# EAGLE design e1_xcvr (EAGLE 7.6.0)
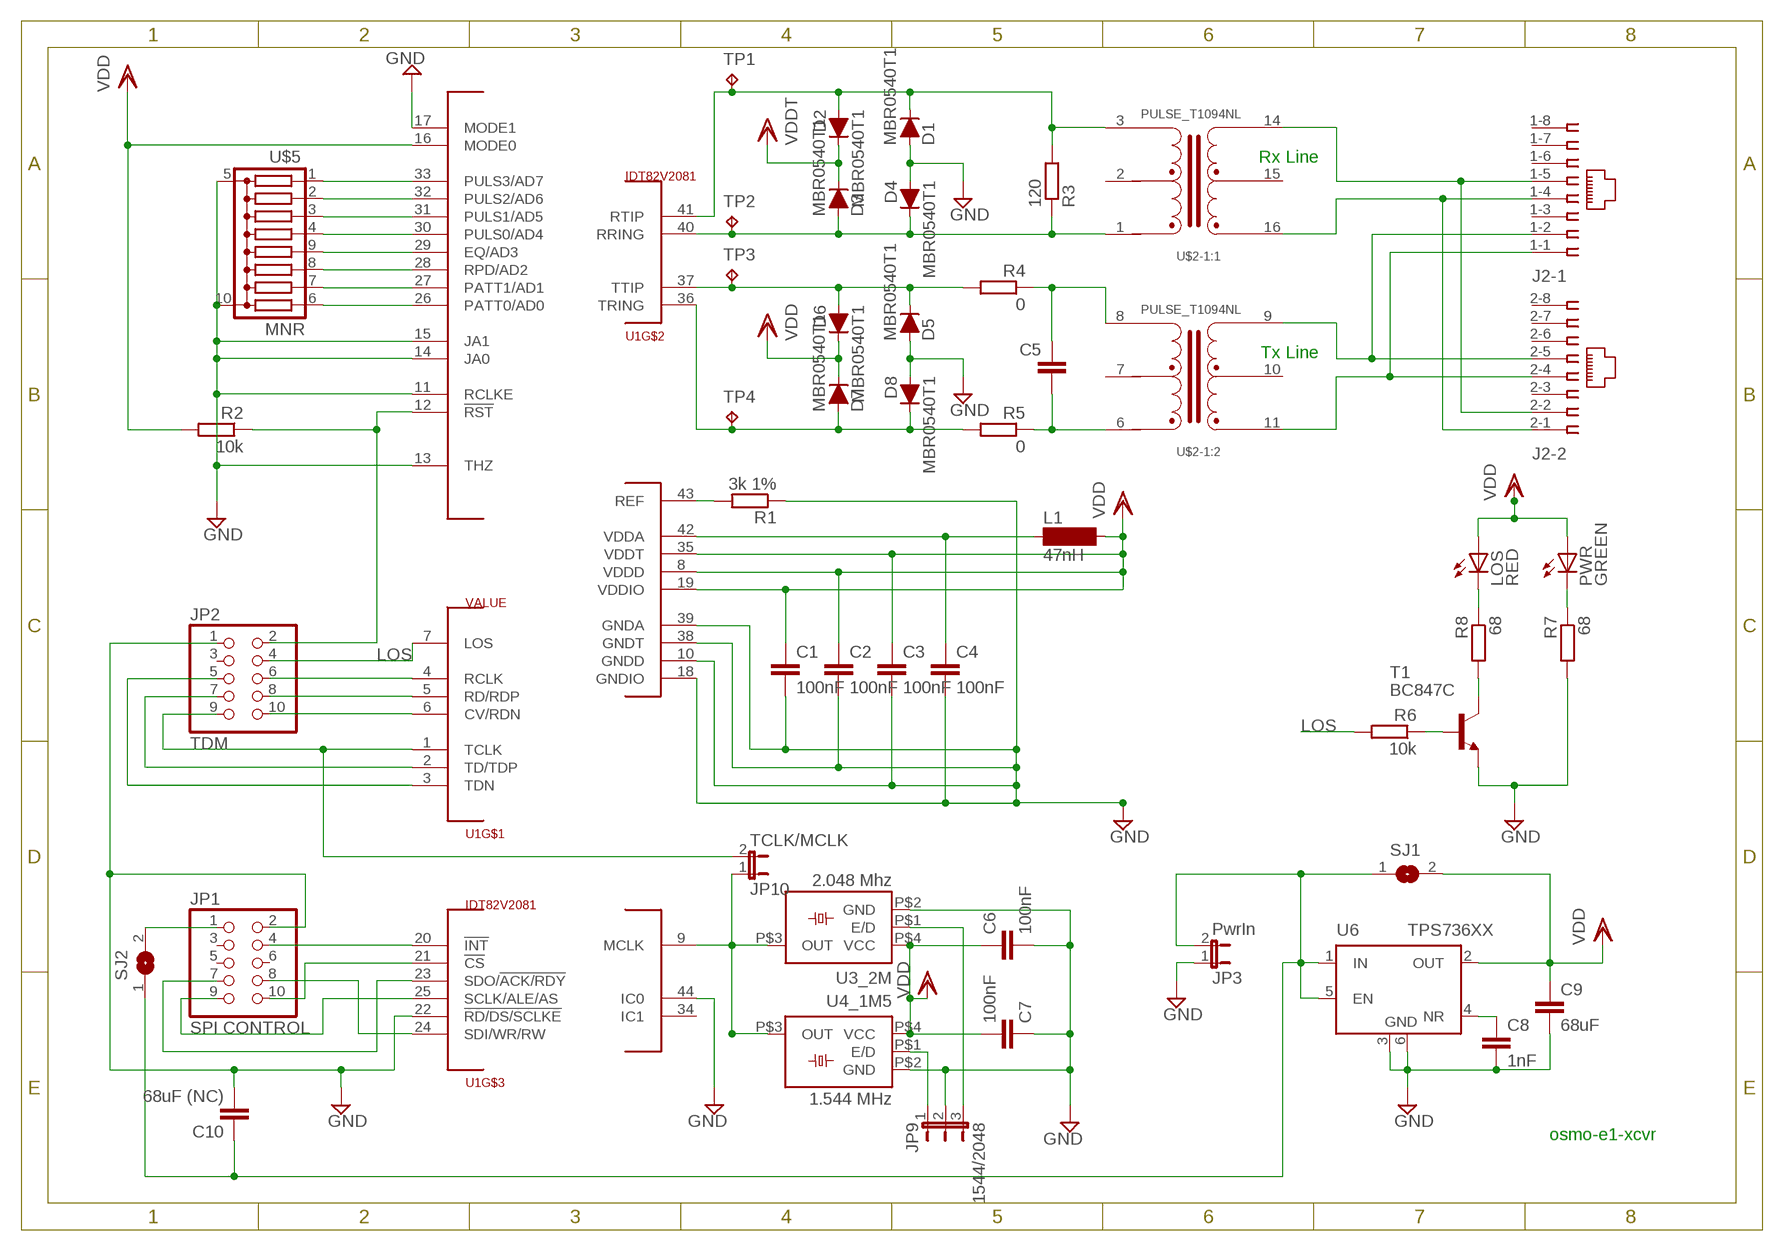
[diagram p0: schematic, sheet 1]

## Parts
C1  100nF  C-EUC0603  [C0603]
C2  100nF  C-EUC0603  [C0603]
C3  100nF  C-EUC0603  [C0603]
C4  100nF  C-EUC0603  [C0603]
C5  C-EUC0603  [C0603]
C6  100nF  C-EUC0603  [C0603]
C7  100nF  C-EUC0603  [C0603]
C8  1nF  C-EUC0603  [C0603]
C9  68uF  C-EUC1206K  [C1206K]
C10  68uF (NC)  C-EUC1206K  [C1206K]
D1  MBR0540T1  D-FILL-SOD123  [SOD123]
D2  MBR0540T1  D-FILL-SOD123  [SOD123]
D3  MBR0540T1  D-FILL-SOD123  [SOD123]
D4  MBR0540T1  D-FILL-SOD123  [SOD123]
D5  MBR0540T1  D-FILL-SOD123  [SOD123]
D6  MBR0540T1  D-FILL-SOD123  [SOD123]
D7  MBR0540T1  D-FILL-SOD123  [SOD123]
D8  MBR0540T1  D-FILL-SOD123  [SOD123]
J2  557560-1  [557560-1]
JP1  SPI CONTROL  PINHD-2X5  [2X05]
JP2  TDM  PINHD-2X5  [2X05]
JP3  PwrIn  JP1E  [JP1]
JP9  1544/2048  JP2E  [JP2]
JP10  TCLK/MCLK  JP1E  [JP1]
L1  47nH  SM-1206  [SM-1206]
LOS  RED  LEDCHIPLED_0805  [CHIPLED_0805]
PWR  GREEN  LEDCHIPLED_0805  [CHIPLED_0805]
R1  3k 1%  R-EU_R0603  [R0603]
R2  10k  R-EU_R0603  [R0603]
R3  120  R-EU_R0603  [R0603]
R4  0  R-EU_R0603  [R0603]
R5  0  R-EU_R0603  [R0603]
R6  10k  R-EU_R0603  [R0603]
R7  68  R-EU_R0603  [R0603]
R8  68  R-EU_R0603  [R0603]
SJ1  SJ  [SJ]
SJ2  SJ  [SJ]
T1  BC847C  BC847C-NPN-SOT23-BEC  [SOT23-BEC]
TP1  TPPAD1-13  [P1-13]
TP2  TPPAD1-13  [P1-13]
TP3  TPPAD1-13  [P1-13]
TP4  TPPAD1-13  [P1-13]
U1  IDT82V2081  [TQFP44]
U3_2M  2.048 Mhz  FOX_FXO-HC73  [HC73]
U4_1M5  1.544 MHz  FOX_FXO-HC73  [HC73]
U6  TPS736XX  [SOT223-6]
U$2  PULSE_T1094NL  [PULSE_BH]
U$5  MNR  [MNR35]

## Nets
!CS: JP1.10 U1.21(!CS)
!INT: JP1.4 U1.20(!INT)
!RST: JP2.2 R2.1 U1.12(!RST)
_VIN [power]: JP1.1 SJ2.2
GND [power]: C1.2 C2.2 C3.2 C4.2 C6.2 C7.1 C8.2 C9.2 C10.2 D1.2(A) D4.2(A) D5.2(A) D8.2(A) JP1.2 JP2.1 JP3.1 JP9.2 R1.1 R7.2 T1.E U1.10(GNDD) U1.11(RCLKE) U1.13(THZ) U1.14(JA0) U1.15(JA1) U1.17(MODE1) U1.18(GNDIO) U1.22(!RD/DS/SCLKE) U1.38(GNDT) U1.39(GNDA) U1.44(IC0) U3_2M.P$2(GND) U4_1M5.P$2(GND) U6.3(GND) U6.6(GND1) U$5.5(C) U$5.10(D)
LOS: JP2.4 R6.2 U1.7(LOS)
MCLK: JP10.1 U1.9(MCLK) U3_2M.P$3(OUT) U4_1M5.P$3(OUT)
N$1: R1.2 U1.43(REF)
N$5: LOS.C R8.1
N$6: U1.33(PULS3/AD7) U$5.1
N$8: U1.32(PULS2/AD6) U$5.2
N$9: U1.31(PULS1/AD5) U$5.3
N$10: U1.30(PULS0/AD4) U$5.4
N$11: U1.29(EQ/AD3) U$5.9
N$12: U1.28(RPD/AD2) U$5.8
N$13: U1.27(PATT1/AD1) U$5.7
N$14: U1.26(PATT0/AD0) U$5.6
N$18: R8.2 T1.C
N$23 [power]: C4.1 L1.1 U1.42(VDDA)
N$26: R6.1 T1.B
N$29: C5.1 R4.1 U$2.8
N$30: PWR.C R7.1
N$31: C5.2 R5.1 U$2.6
N$32: J2.1-2 J2.2-5 U$2.9
N$34: J2.1-4 J2.2-1 U$2.16
N$35: JP9.3 U3_2M.P$1(E/D)
N$36: J2.1-1 J2.2-4 U$2.11
N$37: C8.1 U6.4(NR)
N$38: JP9.1 U4_1M5.P$1(E/D)
N$40: J2.1-5 J2.2-2 U$2.14
RCLK: JP2.6 U1.4(RCLK)
RDN: JP2.10 U1.6(CV/RDN)
RDP: JP2.8 U1.5(RD/RDP)
RRING: D3.2(A) D4.1(C) R3.1 TP2.TP U1.40(RRING) U$2.1
RTIP: D1.1(C) D2.2(A) R3.2 TP1.TP U1.41(RTIP) U$2.3
SCLK: JP1.9 U1.25(SCLK/ALE/AS)
SDI: JP1.8 U1.24(SDI/WR/RW)
SDO: JP1.7 U1.23(SDO/!ACK/RDY)
TCLK: JP2.9 JP10.2 U1.1(TCLK)
TDN: JP2.5 U1.3(TDN)
TDP: JP2.7 U1.2(TD/TDP)
TRING: D7.2(A) D8.1(C) R5.2 TP4.TP U1.36(TRING)
TTIP: D5.1(C) D6.2(A) R4.2 TP3.TP U1.37(TTIP)
VDD [power]: C1.1 C2.1 C3.1 C6.1 C7.2 C9.1 D2.1(C) D3.1(C) D6.1(C) D7.1(C) L1.2 LOS.A PWR.A R2.2 SJ1.2 U1.8(VDDD) U1.16(MODE0) U1.19(VDDIO) U1.35(VDDT) U3_2M.P$4(VCC) U4_1M5.P$4(VCC) U6.2(OUT) ; supply symbol labelled VDDT
VIN [power]: C10.1 JP3.2 SJ1.1 SJ2.1 U6.1(IN) U6.5(EN)
Unconnected: J2.1-3 J2.1-6 J2.1-7 J2.1-8 J2.2-3 J2.2-6 J2.2-7 J2.2-8 JP1.3 JP1.5 JP1.6 JP2.3 U1.34(IC1) U$2.2 U$2.7 U$2.10 U$2.15

## Notes on the sheet
- Rx Line
- Tx Line
- osmo-e1-xcvr

## Library data of the parts
C1-C10 = rcl:C-EU: CAPACITOR, European symbol
D1-D8 = semicon-smd-ipc:D-FILL-: DIODE filled
J2 = con-amp:557560-1: AMP connector
JP1 JP2 = pinhead:PINHD-2X5: PIN HEADER
JP3 JP10 = jumper:JP1E: JUMPER
JP9 = jumper:JP2E: JUMPER
L1 = inductor-neosid:SM-1206: INDUCTOR SMD chip inductor; OC_FARNELL: unknown; OC_NEWARK: unknown
LOS PWR = led:LED: LED OSRAM: - CHIPLED LG R971, LG N971, LY N971, LG Q971, LY Q971, LO R971, LY R971 LH N974, LH R974 LS Q976, LO Q976, LY Q976 LO Q996 - Hyper CHIPLED LW Q18S LB Q993, LB Q99A, LB R99A - SideLED LS A670, LO A670, LY A670, LG A670, LP A670 LB A673, LV A673, LT A673, LW A673 LH A674 LY A675 LS A676, LA A676, LO A676, LY A676, LW A676 LS A679, LY A679, LG A679 - Hyper Micro SIDELED® LS Y876, LA Y876, LO Y876, LY Y876 LT Y87S - SmartLED LW L88C, LW L88S LB L89C, LB L89S, LG L890 LS L89K, LO L89K, LY L89K LS L896, LA L896, LO L896, LY L896 - TOPLED LS T670, LO T670, LY T670, LG T670, LP T670 LSG T670, LSP T670, LSY T670, LOP T670, LYG T670 LG T671, LOG T671, LSG T671 LB T673, LV T673, LT T673, LW T673 LH T674 LS T676, LA T676, LO T676, LY T676, LB T676, LH T676, LSB T676, LW T676 LB T67C, LV T67C, LT T67C, LS T67K, LO T67K, LY T67K, LW E67C LS E67B, LA E67B, LO E67B, LY E67B, LB E67C, LV E67C, LT E67C LW T67C LS T679, LY T679, LG T679 LS T770, LO T770, LY T770, LG T770, LP T770 LB T773, LV T773, LT T773, LW T773 LH T774 LS E675, LA E675, LY E675, LS T675 LS T776, LA T776, LO T776, LY T776, LB T776 LHGB T686 LT T68C, LB T68C - Hyper Mini TOPLED® LB M676 - Mini TOPLED Santana® LG M470 LS M47K, LO M47K, LY M47K Source: http://www.osram.convergy.de LUXEON: - LUMILED® LXK2-PW12-R00, LXK2-PW12-S00, LXK2-PW14-U00, LXK2-PW14-V00 LXK2-PM12-R00, LXK2-PM12-S00, LXK2-PM14-U00 LXK2-PE12-Q00, LXK2-PE12-R00, LXK2-PE12-S00, LXK2-PE14-T00, LXK2-PE14-U00 LXK2-PB12-K00, LXK2-PB12-L00, LXK2-PB12-M00, LXK2-PB14-N00, LXK2-PB14-P00, LXK2-PB14-Q00 LXK2-PR12-L00, LXK2-PR12-M00, LXK2-PR14-Q00, LXK2-PR14-R00 LXK2-PD12-Q00, LXK2-PD12-R00, LXK2-PD12-S00 LXK2-PH12-R00, LXK2-PH12-S00 LXK2-PL12-P00, LXK2-PL12-Q00, LXK2-PL12-R00 Source: www.luxeon.com KINGBRIGHT: KA-3528ASYC Source: www.kingbright.com
R1-R8 = rcl:R-EU_: RESISTOR, European symbol
SJ1 SJ2 = jumper:SJ: SMD solder JUMPER
T1 = transistor:*-NPN-: NPN Transistror BF959 corrected 2008.03.06
TP1-TP4 = testpad:TP: Test pad
U1 = laforge:IDT82V2081
U3_2M U4_1M5 = laforge:FOX_FXO-HC73
U6 = laforge:TPS736XX: TI Cap-Free NMOS 400mA LDO
U$2 = laforge:PULSE_T1094NL
U$5 = laforge:MNR: Rohm 8-element Chip Resistor Network MNR35 (1206x5 size)

## Net classes
0 default: width 0.254 mm
1 power: width 0.508 mm

## Board
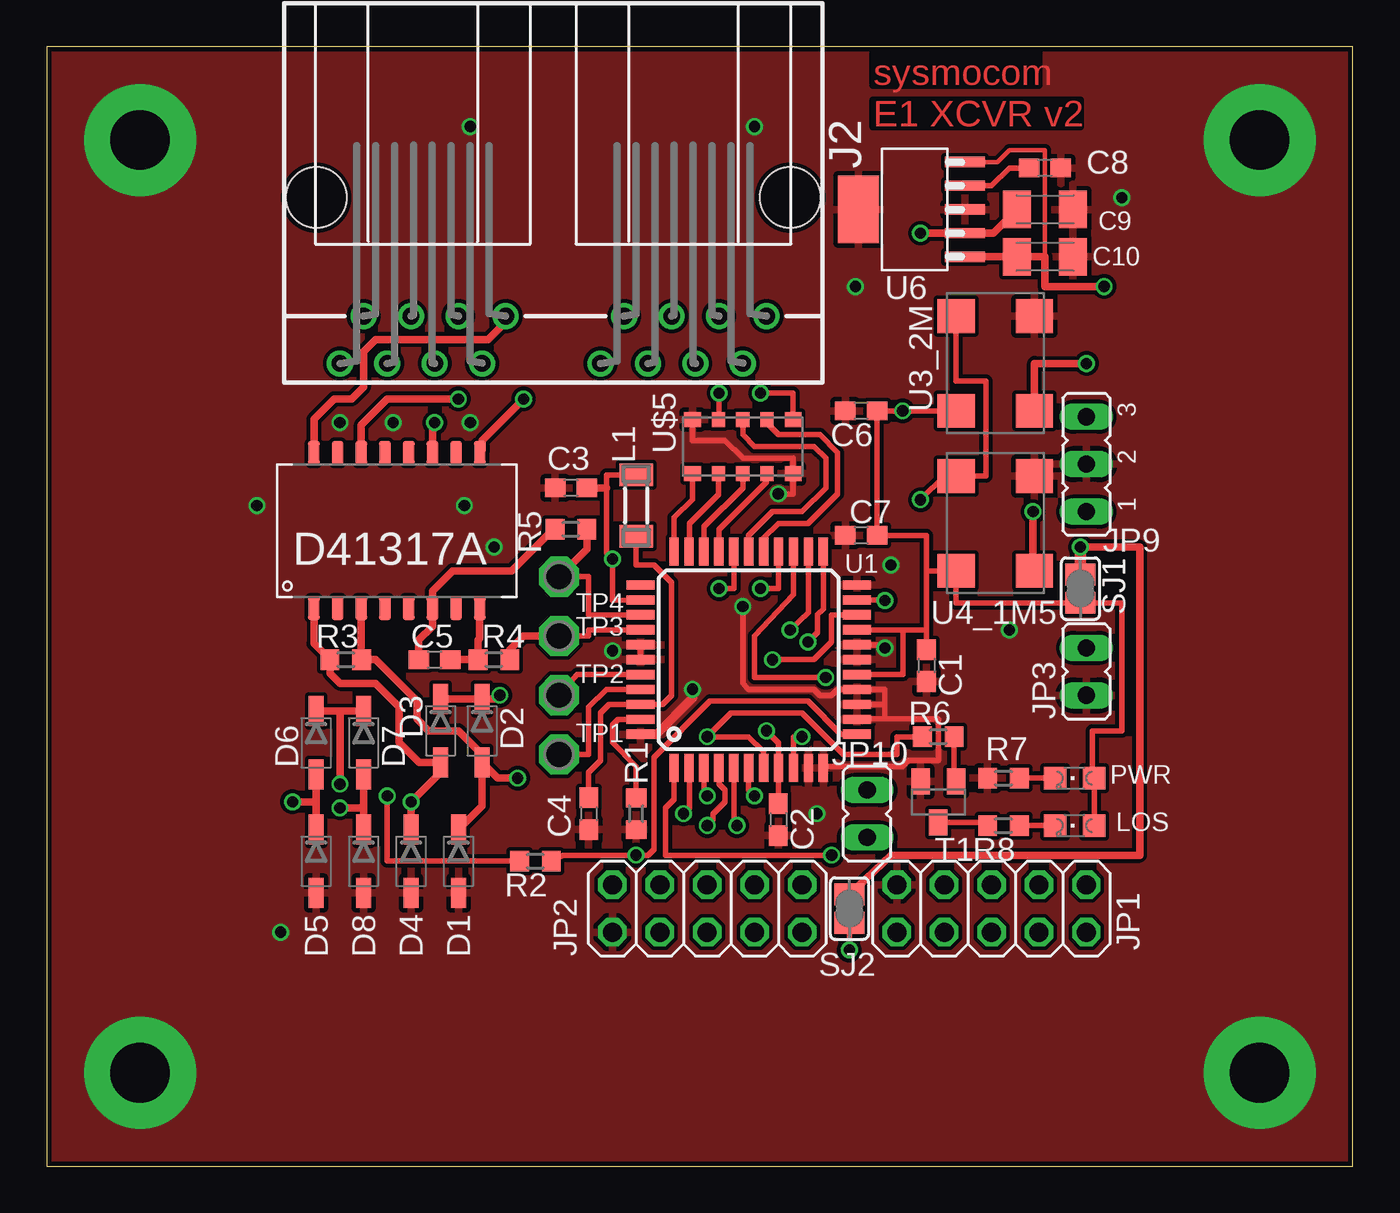
[diagram p1: board, top side]
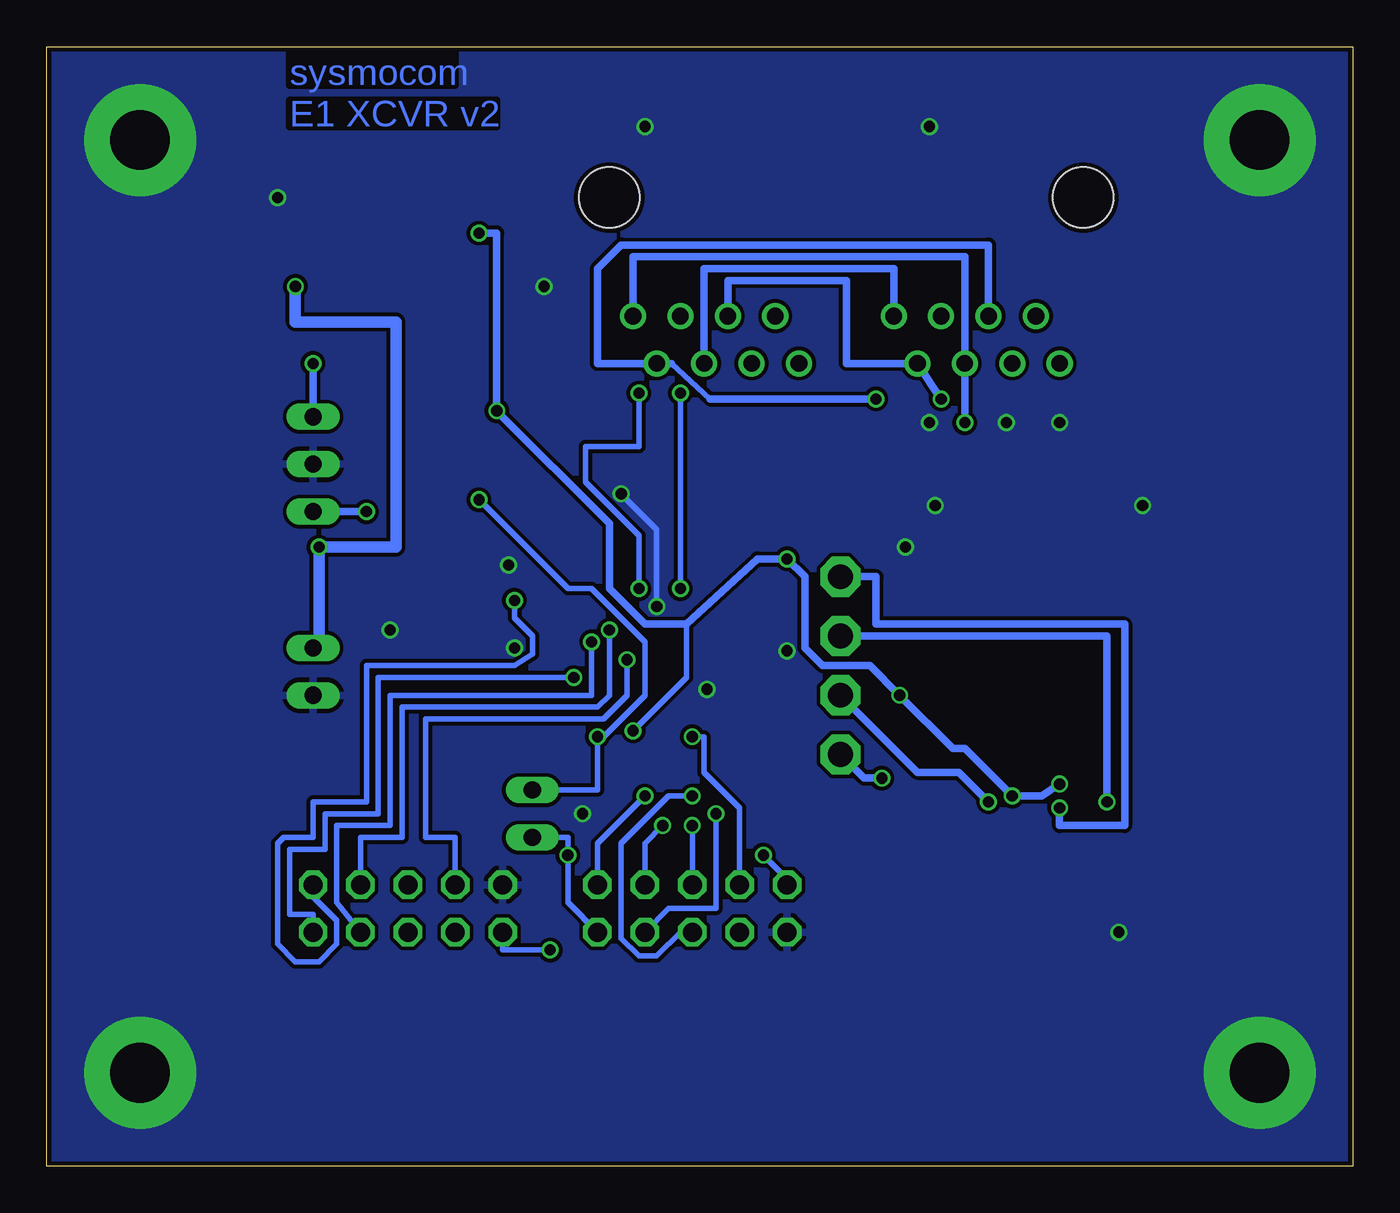
[diagram p2: board, bottom side, seen from below]

Size 70 x 60 mm. Coordinates in mm from the lower left corner, seen from the top.
Outline: 0,0 70,0 70,60 0,60 0,0
Copper layers (1*16): Top 0.035mm / dielectric 1.5mm / Bottom 0.035mm
Design rules "default *": minimum track width 6mil, minimum drill 12mil, track to track 8mil, track to pad 8mil, pad to pad 6mil, via to via 6mil, smd to smd 0mil, copper to edge 10mil, drill to drill 10mil, minimum pad ring 10mil, minimum via ring 6mil, stop-mask expansion 2mil, vias tented up to drill 100mil, thermal gap 10mil

### Footprints (pad centres in the part's own frame; a part is rotated, then mirrored left to right if it is on the bottom)
C0603 = smd 1.1 x 1: 1 -0.85,0; 2 0.85,0
C1206K = smd 1.5 x 2: 1 -1.5,0; 2 1.5,0
SOD123 = smd 1.6 x 0.8: 1 -1.7,0; 2 1.7,0
557560-1 = drill 0.889: 1-1 -11.43,6.35; 1-2 -10.16,8.89; 1-3 -8.89,6.35; 1-4 -7.62,8.89; 1-5 -6.35,6.35; 1-6 -5.08,8.89; 1-7 -3.81,6.35; 1-8 -2.54,8.89; 2-1 2.54,6.35; 2-2 3.81,8.89; 2-3 5.08,6.35; 2-4 6.35,8.89; 2-5 7.62,6.35; 2-6 8.89,8.89; 2-7 10.16,6.35; 2-8 11.43,8.89 | hole 3.251: -12.7,0; 12.7,0
2X05 = drill 1.016 octagon: 1 -5.08,-1.27; 2 -5.08,1.27; 3 -2.54,-1.27; 4 -2.54,1.27; 5 0,-1.27; 6 0,1.27; 7 2.54,-1.27; 8 2.54,1.27; 9 5.08,-1.27; 10 5.08,1.27
JP1 = drill 0.914 long: 1 0,-1.27; 2 0,1.27
JP2 = drill 0.914 long: 1 -2.54,0; 2 0,0; 3 2.54,0
SM-1206 = smd 1.2 x 1.8: 1 -1.65,0; 2 1.65,0
CHIPLED_0805 = smd 1.2 x 1.2: A 0,-1.05; C 0,1.05
R0603 = smd 1 x 1.1: 1 -0.85,0; 2 0.85,0
SJ = smd 1.168 x 1.6: 1 -0.762,0; 2 0.762,0
SOT23-BEC = smd 1 x 1.4: B -0.95,-1.1; C 0,1.1; E 0.95,-1.1
P1-13 = drill 1.321 pad 2.159 octagon: TP 0,0
TQFP44 = smd 1.5 x 0.5: 1 -5.8,4; 2 -5.8,3.2; 3 -5.8,2.4; 4 -5.8,1.6; 5 -5.8,0.8; 6 -5.8,0; 7 -5.8,-0.8; 8 -5.8,-1.6; 9 -5.8,-2.4; 10 -5.8,-3.2; 11 -5.8,-4; 23 5.8,-4; 24 5.8,-3.2; 25 5.8,-2.4; 26 5.8,-1.6; 27 5.8,-0.8; 28 5.8,0; 29 5.8,0.8; 30 5.8,1.6; 31 5.8,2.4; 32 5.8,3.2; 33 5.8,4 | smd 0.5 x 1.5: 12 -4,-5.8; 13 -3.2,-5.8; 14 -2.4,-5.8; 15 -1.6,-5.8; 16 -0.8,-5.8; 17 0,-5.8; 18 0.8,-5.8; 19 1.6,-5.8; 20 2.4,-5.8; 21 3.2,-5.8; 22 4,-5.8; 34 4,5.8; 35 3.2,5.8; 36 2.4,5.8; 37 1.6,5.8; 38 0.8,5.8; 39 0,5.8; 40 -0.8,5.8; 41 -1.6,5.8; 42 -2.4,5.8; 43 -3.2,5.8; 44 -4,5.8
HC73 = smd 1.8 x 2: P$1 0,-4.2; P$2 5.08,-4.2; P$3 5.08,0; P$4 0,0
SOT223-6 = smd 0.55 x 2.15: 1 -2.54,-2.7; 2 -1.27,-2.7; 3 0,-2.7; 4 1.27,-2.7; 5 2.54,-2.7 | smd 3.6 x 2.2: 6 0,3
PULSE_BH = smd 1.27 x 0.635: 1 -4.23,4.25; 2 -4.23,2.98; 3 -4.23,1.71; 4 -4.23,0.44; 5 -4.23,-0.83; 6 -4.23,-2.1; 7 -4.23,-3.37; 8 -4.23,-4.64; 9 4.1,-4.64; 10 4.1,-3.37; 11 4.1,-2.1; 12 4.1,-0.83; 13 4.1,0.44; 14 4.1,1.71; 15 4.1,2.98; 16 4.1,4.25
MNR35 = smd 0.9 x 0.8: 1 -2.7,-1.45; 5 2.7,-1.45; 6 2.7,1.45; 10 -2.7,1.45 | smd 0.7 x 0.8: 2 -1.3,-1.45; 3 0,-1.45; 4 1.3,-1.45; 7 1.3,1.45; 8 0,1.45; 9 -1.3,1.45

### Placement (x,y rotation side)
C1  47.15,26.83 270 top
C2  39.21,18.57 270 top
C3  28.1,36.35 180 top
C4  29.05,18.89 270 top
C5  20.8,27.14 180 top
C6  43.66,40.48 180 top
C7  43.66,33.81 0 top
C8  53.5,53.5 0 top
C9  53.5,51.27 0 top
C10  53.5,48.73 0 top
D1  22.07,16.35 270 top
D2  23.34,23.34 270 top
D3  21.11,23.34 270 top
D4  19.52,16.35 270 top
D5  14.45,16.35 270 top
D6  14.45,22.7 270 top
D7  16.98,22.7 270 top
D8  16.98,16.35 270 top
J2  27.14,51.91 180 top
JP1  50.64,13.81 0 top
JP2  35.4,13.81 0 top
JP3  55.72,26.51 0 top
JP9  55.72,37.62 90 top
JP10  43.97,18.89 180 top
L1  31.59,35.4 90 top
LOS  55.09,18.25 90 top
PWR  55.09,20.8 90 top
R1  31.59,18.89 90 top
R2  26.19,16.35 180 top
R3  16.03,27.14 0 top
R4  23.97,27.14 0 top
R5  28.1,34.13 0 top
R6  47.78,23.02 180 top
R7  51.27,20.8 180 top
R8  51.27,18.25 180 top
SJ1  55.4,30.95 270 top
SJ2  43.02,13.81 270 top
T1  47.78,19.52 180 top
TP1  27.46,22.07 0 top
TP2  27.46,25.24 0 top
TP3  27.46,28.41 0 top
TP4  27.46,31.59 0 top
U1  37.62,27.14 90 top
U3_2M  48.73,40.48 90 top
U4_1M5  48.73,31.91 90 top
U6  46.51,51.27 90 top
U$2  18.57,34.13 90 top
U$5  37.3,38.58 0 top

### Tracks (layer width: path | path; a pad name or v marks a point on that pad's centre or on a via)
!CS  (via drill 0.6)
  Top 0.305: U1.21 44.9,30.34 v44.92,30.32
  Bottom 0.305: JP1.10 55.72,14.45 54.45,13.18 54.45,11.9 55.4,10.95 56.67,10.95 57.62,11.9 57.62,17.3 57.31,17.62 55.72,17.62 55.72,19.52 52.86,19.52 52.86,26.83 44.92,26.83 43.97,27.46 43.97,28.41 44.92,29.37 v44.92,30.32
!INT  (via drill 0.6)
  Top 0.305: U1.20 42.07,29.55 42.07,28.1 41.12,27.14 v38.89,27.14
  Bottom 0.305: JP1.4 48.1,17.62 49.69,17.62 49.69,23.97 40.16,23.97 38.89,25.24 v38.89,27.14
!RST  (via drill 0.6)
  Top 0.305: U1.12 42.58,23.14 40.8,24.92 35.56,24.92 32.54,21.91 32.54,16.98 32.23,16.67 v31.59,16.67 27.68,16.67 R2.1
  Bottom 0.305: JP2.2 30.32,15.4 v31.59,16.67
_VIN  (via drill 0.6)
  Top 0.305: SJ2.2 v43.02,11.59
  Bottom 0.305: JP1.1 45.56,11.59 v43.02,11.59
GND  (via drill 0.6, 3.2 pad 6)
  Top 0.305: U1.38 U1.39 | U1.18 44.76,27.95 v44.92,27.78 | 43.34,24.03 arc90 U1.13 43.42,23.97 44.92,23.97 | U1.11 arc-90 41.71,21.43 45.88,21.43 46.2,21.75 47.78,21.75 47.78,23.97 44.92,23.97 | 44.92,24.75 44.92,25.55 U1.15 42.37,25.55 42.07,25.24 41.43,25.24 41.12,25.56 37.62,25.56 37.3,25.88 v37.3,30 | 44.92,24.75 44.92,23.97 | U1.14 44.92,24.75 | U$5.10 34.6,38.89 36.35,38.89 37.3,37.94 40.01,37.94 U$5.5 40.01,36.03 v39.21,36.03
  Top 0.508: U1.44 32.67,23.14 34.61,25.08 v34.61,25.56
  Bottom 0.305: v37.3,30 37.3,34.13 v39.21,36.03
  other vias: 45.24,32.23 51.59,28.73 22.7,55.72 37.94,55.72 11.27,35.4 22.38,35.4 12.54,12.54 57.62,51.91 43.34,47.15 18.57,39.84 22.7,39.84 15.71,39.84 23.97,33.18 30.32,27.62 41.27,18.89 5,55 5,5 65,5 65,55
  pour Top: 70,60 0,60 0,0 70,0
  pour Bottom: 0,60 70,60 70,0 0,0
LOS  (via drill 0.6)
  Top 0.305: R6.2 45.56,23.02 45.56,22.07 42.7,22.07 40.48,24.29 36.67,24.29 v35.4,23.02 37.62,23.02 38.42,22.22 U1.7
  Bottom 0.305: JP2.4 32.86,19.21 34.77,21.11 34.77,23.02 v35.4,23.02
MCLK  (via drill 0.6)
  Top 0.305: U3_2M.P$3 48.73,42.07 50.32,42.07 50.32,36.99 U4_1M5.P$3 48.1,36.99 v46.83,35.72 | U1.9 40.02,23.02 v40.48,23.02
  Bottom 0.305: JP10.1 40.48,20.16 v40.48,23.02 40.16,23.02 37.94,25.24 37.94,28.1 40.8,30.95 42.07,30.95 v46.83,35.72
N$1
  Top 0.305: U1.43 30.61,23.95 30.32,23.65 30.32,22.7 31.59,21.43 R1.2
N$5
  Top 0.305: LOS.C R8.1
N$6
  Top 0.305: U1.33 33.62,34.77 34.6,35.72 U$5.1
N$8
  Top 0.305: U$5.2 36.01,36.01 34.45,34.45 34.45,32.97 U1.32
N$9
  Top 0.305: U1.31 35.22,34.27 37.3,36.35 U$5.3
N$10
  Top 0.305: U1.30 36.02,34.12 38.58,36.67 38.58,37.09 U$5.4
N$11  (via drill 0.6)
  Top 0.305: U$5.9 36.03,40.05 v36.03,41.43 | U1.29 36.82,30.95 v36.03,30.95
  Bottom 0.305: v36.03,30.95 v36.03,41.43
N$12
  Top 0.305: U1.28 37.62,33.81 38.89,35.08 40.48,35.08 41.75,36.35 41.75,37.94 41.12,38.58 37.94,38.58 37.3,39.21 U$5.8 37.3,40.16
N$13
  Top 0.305: U1.27 38.42,33.66 39.21,34.45 40.8,34.45 42.38,36.03 42.38,38.26 41.43,39.21 39.21,39.21 38.6,39.81 U$5.7
N$14  (via drill 0.6)
  Top 0.305: U1.26 39.22,30.95 v38.26,30.95 | U$5.6 40.01,41.43 v38.26,41.43
  Bottom 0.305: v38.26,30.95 38.26,33.81 41.12,36.67 41.12,38.58 38.26,38.58 v38.26,41.43
N$18
  Top 0.305: T1.C 50.26,18.43 R8.2
N$23
  Top 0.305: C4.1 29.05,21.11 29.68,21.75 29.68,24.29 30.14,24.75 U1.42 33,24.75 33.49,25.24 33.49,31.27 32.54,32.23 31.59,32.23 L1.1
N$26
  Top 0.305: R6.1 48.63,20.73 T1.B
N$29
  Top 0.406: U$2.8 23.21,28.29 23.12,28.2 R4.1 C5.1
N$30
  Top 0.305: PWR.C R7.1
N$31
  Top 0.406: C5.2 19.95,28.2 20.67,28.93 U$2.6 20.67,30.83 21.75,31.91 24.92,31.91 27.14,34.13 R5.1
N$32  (via drill 0.6)
  Top 0.406: v25.56,41.12 23.34,38.89 23.34,38.35 U$2.9
  Bottom 0.305: 36.51,43.02 34.45,41.12
  Bottom 0.406: J2.2-5 19.52,49.37 39.21,49.37 40.48,48.1 40.48,43.02 J2.1-2 36.51,43.02 | 34.45,41.12 v25.56,41.12
N$34
  Top 0.406: J2.2-1 24.61,45.24 23.65,44.29 17.62,44.29 16.98,43.66 16.98,41.75 16.35,41.12 15.4,41.12 14.32,40.04 U$2.16
  Bottom 0.406: J2.2-1 24.61,48.1 34.77,48.1 J2.1-4
N$35  (via drill 0.6)
  Top 0.406: U3_2M.P$1 52.94,43.02 v55.72,43.02
  Bottom 0.406: JP9.3 v55.72,43.02
N$36  (via drill 0.6)
  Top 0.406: U$2.11 20.67,39.72 v20.8,39.84
  Bottom 0.406: J2.1-1 38.58,48.73 20.8,48.73 J2.2-4 v20.8,39.84
N$37
  Top 0.305: U6.4 50.64,52.55 51.59,53.5 C8.1
N$38  (via drill 0.6)
  Top 0.406: U4_1M5.P$1 arc-90 52.86,31.98 v52.86,35.08
  Bottom 0.406: JP9.1 v52.86,35.08
N$40  (via drill 0.6)
  Top 0.406: v22.07,41.12 18.25,41.12 16.86,39.72 U$2.14
  Bottom 0.406: J2.1-5 33.49,47.47 27.14,47.47 27.14,43.02 J2.2-2 v22.07,41.12
RCLK  (via drill 0.6)
  Top 0.305: U1.4 36.02,20.49 36.35,20.16 36.35,19.52 35.72,18.89 35.72,18.57 v35.4,18.25
  Bottom 0.305: JP2.6 v35.4,18.25
RDN  (via drill 0.6)
  Top 0.305: U1.6 37.62,20.16 v37.94,19.84
  Bottom 0.305: JP2.10 40.48,17.3 v37.94,19.84
RDP  (via drill 0.6)
  Top 0.305: U1.5 36.82,18.42 v36.99,18.25
  Bottom 0.305: JP2.8 37.94,17.3 v36.99,18.25
RRING  (via drill 0.6)
  Top 0.305: U1.40 28.41,26.34 TP2.TP
  Top 0.406: U$2.1 14.32,28 R3.1 15.18,26.41 15.71,25.88 17.62,25.88 18.89,24.61 18.89,22.7 19.95,21.64 D3.2 21.11,21.11 v19.52,19.52 D4.1
  Bottom 0.406: TP2.TP 23.34,21.11 21.11,21.11 v19.52,19.52
RTIP  (via drill 0.6)
  Top 0.305: U1.41 30,25.55 29.05,24.61 29.05,22.07 TP1.TP
  Top 0.406: U$2.3 16.86,27.16 R3.2 17.62,27.14 19.84,24.92 19.84,23.97 20.48,23.34 22.07,23.34 23.34,22.07 D2.2 | v25.24,20.8 24.18,20.8 D2.2 | D2.2 23.34,19.32 D1.1
  Bottom 0.406: TP1.TP 26.19,20.8 v25.24,20.8
SCLK  (via drill 0.6)
  Top 0.305: v41.75,26.19 37.94,26.19 37.94,28.41 40.02,30.64 U1.25
  Bottom 0.305: JP1.9 55.72,13.49 56.99,13.49 56.99,16.98 55.09,16.98 55.09,18.89 52.23,18.89 52.23,26.19 v41.75,26.19
SDI  (via drill 0.6)
  Top 0.305: U1.24 40.82,29.68 v39.84,28.73
  Bottom 0.305: JP1.8 53.18,17.62 50.96,17.62 50.96,24.61 40.48,24.61 39.84,25.24 v39.84,28.73
SDO  (via drill 0.6)
  Top 0.305: U1.23 41.62,29.88 41.3,29.56 41.3,28.61 v40.8,28.1
  Bottom 0.305: JP1.7 54.45,14.13 54.45,18.25 51.59,18.25 51.59,25.24 40.8,25.24 v40.8,28.1
TCLK  (via drill 0.6)
  Top 0.305: U1.1 33.62,19.65 33.18,19.21 33.18,16.67 v42.07,16.67
  Bottom 0.305: JP2.9 42.07,14.13 v42.07,16.67 42.07,17.62 JP10.2
TDN  (via drill 0.6)
  Top 0.305: U1.3 35.22,20.02 v35.4,19.84
  Bottom 0.305: JP2.5 36.03,12.54 37.3,11.27 38.26,11.27 39.21,12.22 39.21,17.3 36.67,19.84 v35.4,19.84
TDP  (via drill 0.6)
  Top 0.305: U1.2 arc-90 34.45,21.32 34.45,19.21 v34.13,18.89
  Bottom 0.305: JP2.7 36.67,13.81 34.13,13.81 v34.13,18.89
TRING  (via drill 0.6)
  Top 0.305: TP4.TP 29.05,31.59 29.05,29.55 U1.36
  Top 0.406: D7.2 16.98,19.21 | 16.98,19.21 D8.1 | v15.71,19.21 16.98,19.21 | R5.2 28.95,33.08 TP4.TP
  Bottom 0.406: v15.71,19.21 15.71,18.25 12.22,18.25 12.22,29.05 25.56,29.05 25.56,31.59 TP4.TP
TTIP  (via drill 0.6)
  Top 0.305: U1.37 29.05,28.75 29.05,28.41 TP3.TP
  Top 0.406: D6.2 14.45,19.52 | 14.45,19.52 D5.1 | 14.45,19.52 v13.18,19.52 | R4.2 24.82,27.68 25.56,28.41 TP3.TP
  Bottom 0.406: TP3.TP 13.18,28.41 v13.18,19.52
VDD  (via drill 0.6)
  Top 0.254: 15.71,24.29 D7.1 | 49.05,50.01 U6.2
  Top 0.305: C2.1 39.22,19.43 U1.8 39.22,22.69 v38.58,23.34 | U1.19 45.88,28.75 | 45.88,28.75 46.21,28.75 | 46.21,28.75 46.2,28.73 | U3_2M.P$4 v45.88,40.48 C6.1 C7.2 47.15,33.81 47.15,31.91 | 47.15,31.91 U4_1M5.P$4 48.73,30.19 SJ1.2 57.62,30.19 57.62,23.34 56.04,23.34 56.04,20.8 PWR.A LOS.A | C1.1 47.15,28.75 | C9.1 51.91,51.27 | L1.2 30,37.05 30,36.35 30,32.86 v30.32,32.54 30.32,30.32 U1.35 | U1.16 45.88,26.34 45.88,28.75 | R2.2 18.25,16.35 v18.25,19.84 | 46.21,28.75 47.15,28.75 | 47.15,28.75 47.15,31.91
  Top 0.406: D6.1 D7.1 | U6.2 50.73,50.01 C9.1 | v46.83,50.01 49.05,50.01 | v15.71,20.48 15.71,24.29 | v24.29,25.24 24.08,25.04 D2.1 D3.1 | C3.1 30,36.35
  Bottom 0.305: v38.58,23.34 35.72,26.19 35.72,29.05
  Bottom 0.406: v46.83,50.01 45.88,50.01 v45.88,40.48 39.84,34.45 39.84,30.95 37.94,29.05 35.72,29.05 31.91,32.54 v30.32,32.54 29.37,31.59 29.37,27.78 28.41,26.83 25.88,26.83 v24.29,25.24 21.43,22.38 20.8,22.38 v18.25,19.84 16.67,19.84 v15.71,20.48
VIN  (via drill 0.6)
  Top 0.254: 53.5,48.73 53.5,54.45 51.59,54.45 50.96,53.81 U6.5
  Top 0.406: 49.05,48.73 U6.1 C10.1 53.5,48.73 53.5,47.15 v56.67,47.15 | SJ2.1 45.24,16.67 58.58,16.67 58.58,33.18 v55.4,33.18
  Top 0.61: SJ1.1 v55.4,33.18
  Bottom 0.61: JP3.2 55.4,27.78 v55.4,33.18 51.27,33.18 51.27,45.24 56.67,45.24 v56.67,47.15

### Text on the board
Top: sysmocom | E1 XCVR v2
Bottom: sysmocom | E1 XCVR v2
tNames: D41317A